# Altium project SCB.PrjPCB (part 4 of 8)

## Sheet FPGA_Configuration.SchDoc: FPGA_Configuration
size A3; Date: 18/06/2014; DrawnBy: J. Gabriel R.E.; Organization: Seven Solutions S.L.; Address1: C/Baza, Parcela 19, Nave 3; Address2: Polígono Ind. Juncaril; Address3: 18210-Peligros-Granada; Address4: Spain; Revision: 3.4; SheetNumber: 8; SheetTotal: 23; WebAddress: www.sevensols.com; Project: White Rabbit; ProjectName: Project Name
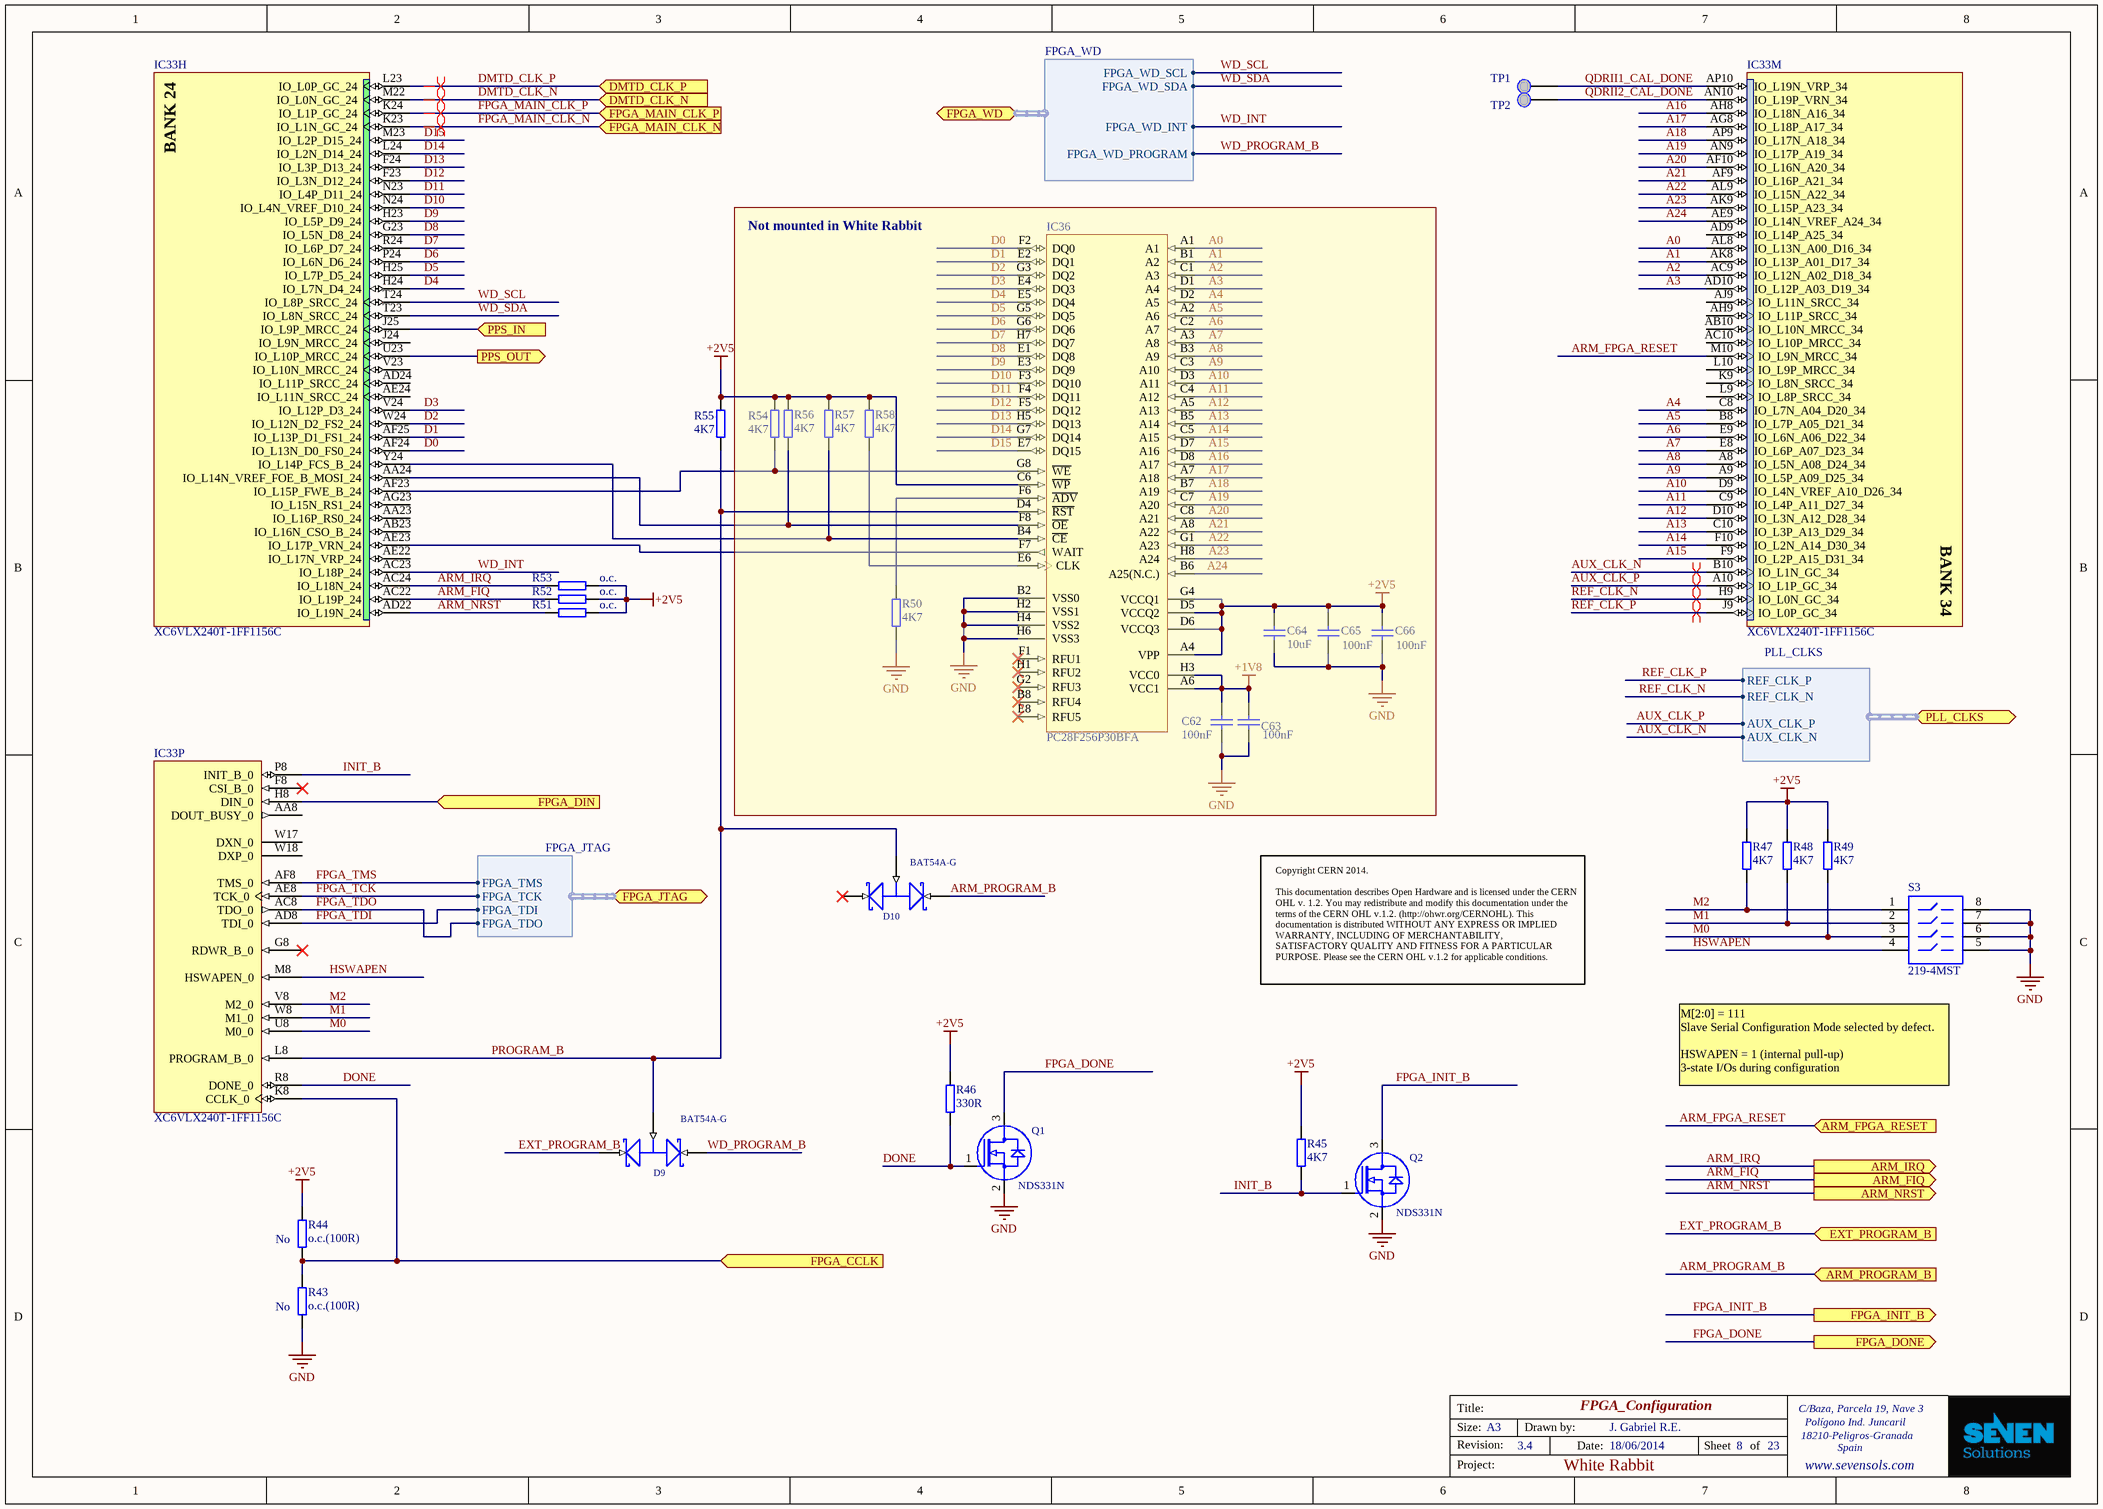
[diagram p11: FPGA_Configuration.SchDoc]

### Parts
C62  100nF  [CC1005-0402]
C63  100nF  [CC1005-0402]
C64  10uF  [CC1608-0603]
C65  100nF  [CC1005-0402]
C66  100nF  [CC1005-0402]
D9  BAT54A-G  [SOT23]
D10  BAT54A-G  [SOT23]
IC33  XC6VLX240T-1FF1156C  [FF1156]  (parts H,M,P of 20)
IC36  PC28F256P30BFA  [BGA64C100P8X8_1300X1000X120]
Q1  NDS331N  [SOT23-3]
Q2  NDS331N  [SOT23-3]
R43  value o.c.(100R)  Mounted: No  [0402]  (hidden comment: 100R(o.c.))
R44  value o.c.(100R)  Mounted: No  [0402]  (hidden comment: 100R(o.c.))
R45  4K7  [0402]
R46  330R  [0402]
R47  4K7  [0402]
R48  4K7  [0402]
R49  4K7  [0402]
R50  4K7  [0402]
R51  o.c.  [0402]
R52  o.c.  [0402]
R53  o.c.  [0402]
R54  4K7  [0402]
R55  4K7  [0402]
R56  4K7  [0402]
R57  4K7  [0402]
R58  4K7  [0402]
S3  219-4MST  [NHDS-8]
TP1  Test Point  [TEST_PAD_1mm]  (value not drawn)
TP2  Test Point  [TEST_PAD_1mm]  (value not drawn)

### Blocks framed on the sheet
Not mounted in White Rabbit: C62-C66 IC36 R50 R54 R56-R58

### Ports
ARM_FIQ (out), ARM_FPGA_RESET (in), ARM_IRQ (out), ARM_NRST (out), ARM_PROGRAM_B (in), DMTD_CLK_N (in), DMTD_CLK_P (in), EXT_PROGRAM_B (in), FPGA_CCLK (in), FPGA_DIN (in), FPGA_DONE (out), FPGA_INIT_B (out), FPGA_JTAG (harness FPGA_JTAG), FPGA_MAIN_CLK_N (in), FPGA_MAIN_CLK_P (in), FPGA_WD (harness FPGA_WD), PLL_CLKS (harness PLL_CLKS), PPS_IN (in), PPS_OUT (out)

### Harnesses
FPGA_JTAG: FPGA_TMS, FPGA_TCK, FPGA_TDI, FPGA_TDO
FPGA_WD: FPGA_WD_SCL, FPGA_WD_SDA, FPGA_WD_INT, FPGA_WD_PROGRAM
PLL_CLKS: REF_CLK_P, REF_CLK_N, AUX_CLK_P, AUX_CLK_N

### Nets
+1V8: C62.2 C63.2 IC36.A6(VCC1) IC36.H3(VCC0)
+2V5: C64.2 C65.2 C66.2 IC36.A4(VPP) IC36.C6(~{WP}) IC36.D5(VCCQ2) IC36.D6(VCCQ3) IC36.G4(VCCQ1) R44.2 R45.1 R46.2 R47.2 R48.2 R49.2 R51.1 R52.1 R53.1 R54.2 R55.2 R56.2 R57.2 R58.2
GND: C62.1 C63.1 C64.1 C65.1 C66.1 IC36.B2(VSS0) IC36.H2(VSS1) IC36.H4(VSS2) IC36.H6(VSS3) Q1.2(SOURCE) Q2.2(SOURCE) R43.1 R50.1 S3.5 S3.6 S3.7 S3.8
A0: IC33.AL8(IO_L13N_A00_D16_34) IC36.A1
A1: IC33.AK8(IO_L13P_A01_D17_34) IC36.B1(A2)
A2: IC33.AC9(IO_L12N_A02_D18_34) IC36.C1(A3)
A3: IC33.AD10(IO_L12P_A03_D19_34) IC36.D1(A4)
A4: IC33.C8(IO_L7N_A04_D20_34) IC36.D2(A5)
A5: IC33.B8(IO_L7P_A05_D21_34) IC36.A2(A6)
A6: IC33.E9(IO_L6N_A06_D22_34) IC36.C2(A7)
A7: IC33.E8(IO_L6P_A07_D23_34) IC36.A3(A8)
A8: IC33.A8(IO_L5N_A08_D24_34) IC36.B3(A9)
A9: IC33.A9(IO_L5P_A09_D25_34) IC36.C3(A10)
A10: IC33.D9(IO_L4N_VREF_A10_D26_34) IC36.D3(A11)
A11: IC33.C9(IO_L4P_A11_D27_34) IC36.C4(A12)
A12: IC33.D10(IO_L3N_A12_D28_34) IC36.A5(A13)
A13: IC33.C10(IO_L3P_A13_D29_34) IC36.B5(A14)
A14: IC33.F10(IO_L2N_A14_D30_34) IC36.C5(A15)
A15: IC33.F9(IO_L2P_A15_D31_34) IC36.D7(A16)
A16: IC33.AH8(IO_L18N_A16_34) IC36.D8(A17)
A17: IC33.AG8(IO_L18P_A17_34) IC36.A7(A18)
A18: IC33.AP9(IO_L17N_A18_34) IC36.B7(A19)
A19: IC33.AN9(IO_L17P_A19_34) IC36.C7(A20)
A20: IC33.AF10(IO_L16N_A20_34) IC36.C8(A21)
A21: IC33.AF9(IO_L16P_A21_34) IC36.A8(A22)
A22: IC33.AL9(IO_L15N_A22_34) IC36.G1(A23)
A23: IC33.AK9(IO_L15P_A23_34) IC36.H8(A24)
A24: IC33.AE9(IO_L14N_VREF_A24_34) IC36.B6(A25(N.C.))
ARM_FIQ: IC33.AC22(IO_L19P_24) R52.2 ; port ARM_FIQ
ARM_FPGA_RESET: IC33.M10(IO_L9N_MRCC_34) ; port ARM_FPGA_RESET
ARM_IRQ: IC33.AC24(IO_L18N_24) R53.2 ; port ARM_IRQ
ARM_NRST: IC33.AD22(IO_L19N_24) R51.2 ; port ARM_NRST
ARM_PROGRAM_B: D10.2(K2) ; port ARM_PROGRAM_B
AUX_CLK_N: IC33.B10(IO_L1N_GC_34) ; port PLL_CLKS.AUX_CLK_N
AUX_CLK_P: IC33.A10(IO_L1P_GC_34) ; port PLL_CLKS.AUX_CLK_P
D0: IC33.AF24(IO_L13N_D0_FS0_24) IC36.F2(DQ0)
D1: IC33.AF25(IO_L13P_D1_FS1_24) IC36.E2(DQ1)
D2: IC33.W24(IO_L12N_D2_FS2_24) IC36.G3(DQ2)
D3: IC33.V24(IO_L12P_D3_24) IC36.E4(DQ3)
D4: IC33.H24(IO_L7N_D4_24) IC36.E5(DQ4)
D5: IC33.H25(IO_L7P_D5_24) IC36.G5(DQ5)
D6: IC33.P24(IO_L6N_D6_24) IC36.G6(DQ6)
D7: IC33.R24(IO_L6P_D7_24) IC36.H7(DQ7)
D8: IC33.G23(IO_L5N_D8_24) IC36.E1(DQ8)
D9: IC33.H23(IO_L5P_D9_24) IC36.E3(DQ9)
D10: IC33.N24(IO_L4N_VREF_D10_24) IC36.F3(DQ10)
D11: IC33.N23(IO_L4P_D11_24) IC36.F4(DQ11)
D12: IC33.F23(IO_L3N_D12_24) IC36.F5(DQ12)
D13: IC33.F24(IO_L3P_D13_24) IC36.H5(DQ13)
D14: IC33.L24(IO_L2N_D14_24) IC36.G7(DQ14)
D15: IC33.M23(IO_L2P_D15_24) IC36.E7(DQ15)
DMTD_CLK_N: IC33.M22(IO_L0N_GC_24) ; port DMTD_CLK_N
DMTD_CLK_P: IC33.L23(IO_L0P_GC_24) ; port DMTD_CLK_P
DONE: IC33.R8(DONE_0) Q1.1(GATE) R46.1
EXT_PROGRAM_B: D9.1(K1) ; port EXT_PROGRAM_B
FPGA_CLK: IC33.K8(CCLK_0) R43.2 R44.1 ; port FPGA_CCLK
FPGA_DIN: IC33.H8(DIN_0) ; port FPGA_DIN
FPGA_DONE: Q1.3(DRAIN) ; port FPGA_DONE
FPGA_INIT_B: Q2.3(DRAIN) ; port FPGA_INIT_B
FPGA_MAIN_CLK_N: IC33.K23(IO_L1N_GC_24) ; port FPGA_MAIN_CLK_N  [project net FPGA_25MHZ_CLK_N]
FPGA_MAIN_CLK_P: IC33.K24(IO_L1P_GC_24) ; port FPGA_MAIN_CLK_P  [project net FPGA_25MHZ_CLK_P]
FPGA_TCK: IC33.AE8(TCK_0) ; port FPGA_JTAG.FPGA_TCK  [project net FPGA_JTAG.FPGA_TCK]
FPGA_TDI: IC33.AD8(TDI_0) ; port FPGA_JTAG.FPGA_TDI  [project net FPGA_JTAG.FPGA_TDI]
FPGA_TDO: IC33.AC8(TDO_0) ; port FPGA_JTAG.FPGA_TDO  [project net FPGA_JTAG.FPGA_TDO]
FPGA_TMS: IC33.AF8(TMS_0) ; port FPGA_JTAG.FPGA_TMS  [project net FPGA_JTAG.FPGA_TMS]
HSWAPEN: IC33.M8(HSWAPEN_0) S3.4
INIT_B: IC33.P8(INIT_B_0) Q2.1(GATE) R45.2
M0: IC33.U8(M0_0) R49.1 S3.3
M1: IC33.W8(M1_0) R48.1 S3.2
M2: IC33.V8(M2_0) R47.1 S3.1
PPS_OUT: IC33.U23(IO_L10P_MRCC_24) ; port PPS_OUT
PROGRAM_B: D9.3(A) D10.3(A) IC33.L8(PROGRAM_B_0) IC36.D4(~{RST}) R55.1
QDRII1_CAL_DONE: IC33.AP10(IO_L19N_VRP_34) TP1.1(TP)
QDRII2_CAL_DONE: IC33.AN10(IO_L19P_VRN_34) TP2.1(TP)
REF_CLK_N: IC33.H9(IO_L0N_GC_34) ; port PLL_CLKS.REF_CLK_N  [project net PLL_CLKS.REF_CLK_N]
REF_CLK_P: IC33.J9(IO_L0P_GC_34) ; port PLL_CLKS.REF_CLK_P  [project net PLL_CLKS.REF_CLK_P]
WD_INT: IC33.AC23(IO_L18P_24) ; port FPGA_WD.FPGA_WD_INT  [project net FPGA_WD.FPGA_WD_INT]
WD_PROGRAM_B: D9.2(K2) ; port FPGA_WD.FPGA_WD_PROGRAM  [project net FPGA_WD.FPGA_WD_PROGRAM]
WD_SCL: IC33.T24(IO_L8P_SRCC_24) ; port FPGA_WD.FPGA_WD_SCL  [project net FPGA_WD.FPGA_WD_SCL]
WD_SDA: IC33.T23(IO_L8N_SRCC_24) ; port FPGA_WD.FPGA_WD_SDA  [project net FPGA_WD.FPGA_WD_SDA]
NetIC33_AA24: IC33.AA24(IO_L14N_VREF_FOE_B_MOSI_24) IC36.F8(~{OE}) R56.1
NetIC33_AE23: IC33.AE23(IO_L17P_VRN_24) IC36.F7(WAIT)
NetIC33_AF23: IC33.AF23(IO_L15P_FWE_B_24) IC36.G8(~{WE}) R54.1
NetIC33_J25: IC33.J25(IO_L9P_MRCC_24) ; port PPS_IN
NetIC33_Y24: IC33.Y24(IO_L14P_FCS_B_24) IC36.B4(~{CE}) R57.1
NetIC36_E6: IC36.E6(CLK) R58.1
NetIC36_F6: IC36.F6(~{ADV}) R50.2

Not connected (* = marked no-connect by the designer): D10 1(K1)*; IC33 AA8(DOUT_BUSY_0) AA23(IO_L16P_RS0_24) AB10(IO_L10N_MRCC_34) AB23(IO_L16N_CSO_B_24) AC10(IO_L10P_MRCC_34) AD9(IO_L14P_A25_34) AD24(IO_L11P_SRCC_24) AE22(IO_L17N_VRP_24) AE24(IO_L11N_SRCC_24) AG23(IO_L15N_RS1_24) AH9(IO_L11P_SRCC_34) AJ9(IO_L11N_SRCC_34) F8(CSI_B_0)* G8(RDWR_B_0)* J24(IO_L9N_MRCC_24) K9(IO_L8N_SRCC_34) L9(IO_L8P_SRCC_34) L10(IO_L9P_MRCC_34) V23(IO_L10N_MRCC_24) W17(DXN_0) W18(DXP_0); IC36 B8(RFU4)* E8(RFU5)* F1(RFU1)* G2(RFU3)* H1(RFU2)*

### Layout directives
differential pair: AUX_CLK_N, AUX_CLK_P, DMTD_CLK_N, DMTD_CLK_P, FPGA_25MHZ_CLK_N, FPGA_25MHZ_CLK_P, PLL_CLKS.REF_CLK_N, PLL_CLKS.REF_CLK_P

### Notes on the sheet
- Copyright CERN 2014.
  This documentation describes Open Hardware and is licensed under the CERN OHL v. 1.2. You may redistribute and modify this documentation under the terms of the CERN OHL v.1.2. (http://ohwr.org/CERNOHL). This documentation is distributed WITHOUT ANY EXPRESS OR IMPLIED WARRANTY, INCLUDING OF MERCHANTABILITY, SATISFACTORY QUALITY AND FITNESS FOR A PARTICULAR PURPOSE. Please see the CERN OHL v.1.2 for applicable conditions.
- M[2:0] = 111
  Slave Serial Configuration Mode selected by defect.
  HSWAPEN = 1 (internal pull-up)
  3-state I/Os during configuration
- Title:
- Size:
- Revision:
- A3
- Drawn by:
- Date:
- Sheet
- of
- Project:
- (in symbol XC6VLX130T-1FF1156C, part H) BANK 24
- (in symbol XC6VLX130T-1FF1156C, part M) BANK 34

### Library data of the parts
C62 C63 C65 C66 = CC0402_100NF_16V_10%_X7R: Capacitor; Manufacturer1: TDK; Manufacturer1 PN: C1005X7R1C104K; TC: X7R; Tolerance: ±10%; Voltage: 16V; Mounted: No; Published: 8-Jun-2000; LatestRevisionDate: 17-Jul-2002; LatestRevisionNote: Re-released for DXP Platform.; PackageReference: RAD-0.3; Publisher: Altium Limited; Distributor1: Digikey; Distributor1 PN: 445-4952-1-ND; Case: 0402; Value: 100nF
C64 = CC0603_10UF_6.3V_20%_X5R: Capacitor; Manufacturer1: TDK; Manufacturer1 PN: C1608X5R0J106M; TC: X5R; Tolerance: ±20%; Voltage: 6.3V; Mounted: No; Published: 8-Jun-2000; LatestRevisionDate: 17-Jul-2002; LatestRevisionNote: Re-released for DXP Platform.; PackageReference: RAD-0.3; Publisher: Altium Limited; Distributor1: Digikey; Distributor1 PN: 445-4112-1-ND; Case: 0603; Value: 10uF
D9 D10 = BAT54A.1: Schottky Barrier Double Diode; PACKAGE_INFORMATION: Latest Revision: May-1999; DEVICE: BAT54A-G; PKG_TYPE: SOT23; PUBLISHED: 17-Sep-2003; DATASHEET: Latest Revision: 4-Mar-2002; PACKAGE_REFERENCE: SOT23; PUBLISHER: Altium Limited; Value: BAT54A-G; Distributor1 PN: 641-1319-1-ND; Distributor1: Digikey
IC33 = XC6VLX130T-1FF1156C: Virtex-6 LXT Platform FPGA, 600 User I/Os, 20 GTXs, 1156-Ball FFBGA, Speed Grade 1, Commercial Grade; FirstPublished: 17-Nov-2009; DatasheetVersion: v2.0, Sep-2009; PackageVersion: ver1.0, Jun-2009; PackageReference: FF1156; Publisher: Altium Limited; PackageDescription: 1156-Ball Flip-Chip Fine Pitch Ball Grid Array (FF1156); Code_JEDEC: MS-034-AAR-1; Code_IPC: BGA100P34X34-1156; ComponentLink1Description: Virtex-6 Datasheet; ComponentLink1URL: http://www.xilinx.com/support/documentation/data_sheets/ds150.pdf; ComponentLink2Description: Pinout Specification; ComponentLink2URL: http://www.xilinx.com/support/packagefiles/virtex-6-pkgs.htm; ComponentLink3Description: FF1156 Package Drawing; ComponentLink3URL: http://www.xilinx.com/support/documentation/package_specs/ff1156.pdf; ComponentLink4Description: Virtex-6 Documents; ComponentLink4URL: http://www.xilinx.com/support/documentation/virtex-6.htm; ComponentLink5Description: Xilinx.com Home; ComponentLink5URL: http://www.xilinx.com
IC36 = PC28F256P30BFA: NOR Flash Memory, 256Mbit; Mounted: No; Value: PC28F256P30BFA; Distributor1 PN: PC28F256P30BFA-ND; Distributor1: Digikey; Case: TBGA-64
Q1 Q2 = NDS331N: N-Channel Logic Level Enhancement Mode Field Effect Transistor; DEVICE: NDS331N; VALUE: NDS331N; Distributor1 PN: NDS331NCT-ND; Distributor1: Digikey
R43 R44 = R0402_100R_±1%_0.1W_100PPM: SMD Resistor; Manufacturer1: Panasonic; Manufacturer1 PN: ERJ-2RKF1000X; TCR: 100ppm; Power Rating: 0.1W; Tolerance: ±1%; Case: 0402; Distributor1: DigiKey; Distributor1 PN: P100LCT-ND
R45 R47-R49 R55 = R0402_4.7K_±1%_0.1W_100PPM: SMD Resistor; Manufacturer1: Panasonic; Manufacturer1 PN: ERJ-2RKF4701X; TCR: 100ppm; Power Rating: 0.1W; Tolerance: ±1%; Case: 0402; Distributor1: DigiKey; Distributor1 PN: ERJ-2RKF4701X; Value: 4K7
R46 = R0402_330R_±1%_0.1W_100PPM: SMD Resistor; Manufacturer1: Panasonic; Manufacturer1 PN: ERJ-2RKF3300X; TCR: 100ppm; Power Rating: 0.1W; Tolerance: ±1%; Case: 0402; Distributor1: DigiKey; Distributor1 PN: P330LCT-ND; Value: 330R
R50 R54 R56-R58 = R0402_4.7K_±1%_0.1W_100PPM: SMD Resistor; Manufacturer1: Panasonic; Manufacturer1 PN: ERJ-2RKF4701X; TCR: 100ppm; Power Rating: 0.1W; Tolerance: ±1%; Mounted: No; Case: 0402; Distributor1: DigiKey; Distributor1 PN: ERJ-2RKF4701X; Value: 4K7
R51-R53 = R0402_O.C.: SMD Resistor; Mounted: No; Case: 0402; Manufacturer1: N/A; Manufacturer1 PN: N/A; Distributor1: N/A; Distributor1 PN: N/A; TCR: N/A; Power Rating: N/A; Tolerance: N/A; Value: o.c.
S3 = SW-DIP4: 4 Positions DIP SWITCH; Manufacturer: CTS Electrocomponents; Mounted: No; Value: 219-4MST; Distributor1 PN: CT2194MST-ND; Distributor1: Digikey
TP1 TP2 = TEST_POINT: SMD 1mm Test Point

## Sheet CPU_IO_Ports.SchDoc: CPU_IO_Ports
size A4; Date: 18/06/2014; DrawnBy: J. Gabriel R.E.; Organization: Seven Solutions S.L.; Address1: C/Baza, Parcela 19, Nave 3; Address2: Polígono Ind. Juncaril; Address3: 18210-Peligros-Granada; Address4: Spain; Revision: 3.4; SheetNumber: 9; SheetTotal: 23; WebAddress: www.sevensols.com; Project: White Rabbit; ProjectName: White Rabbit
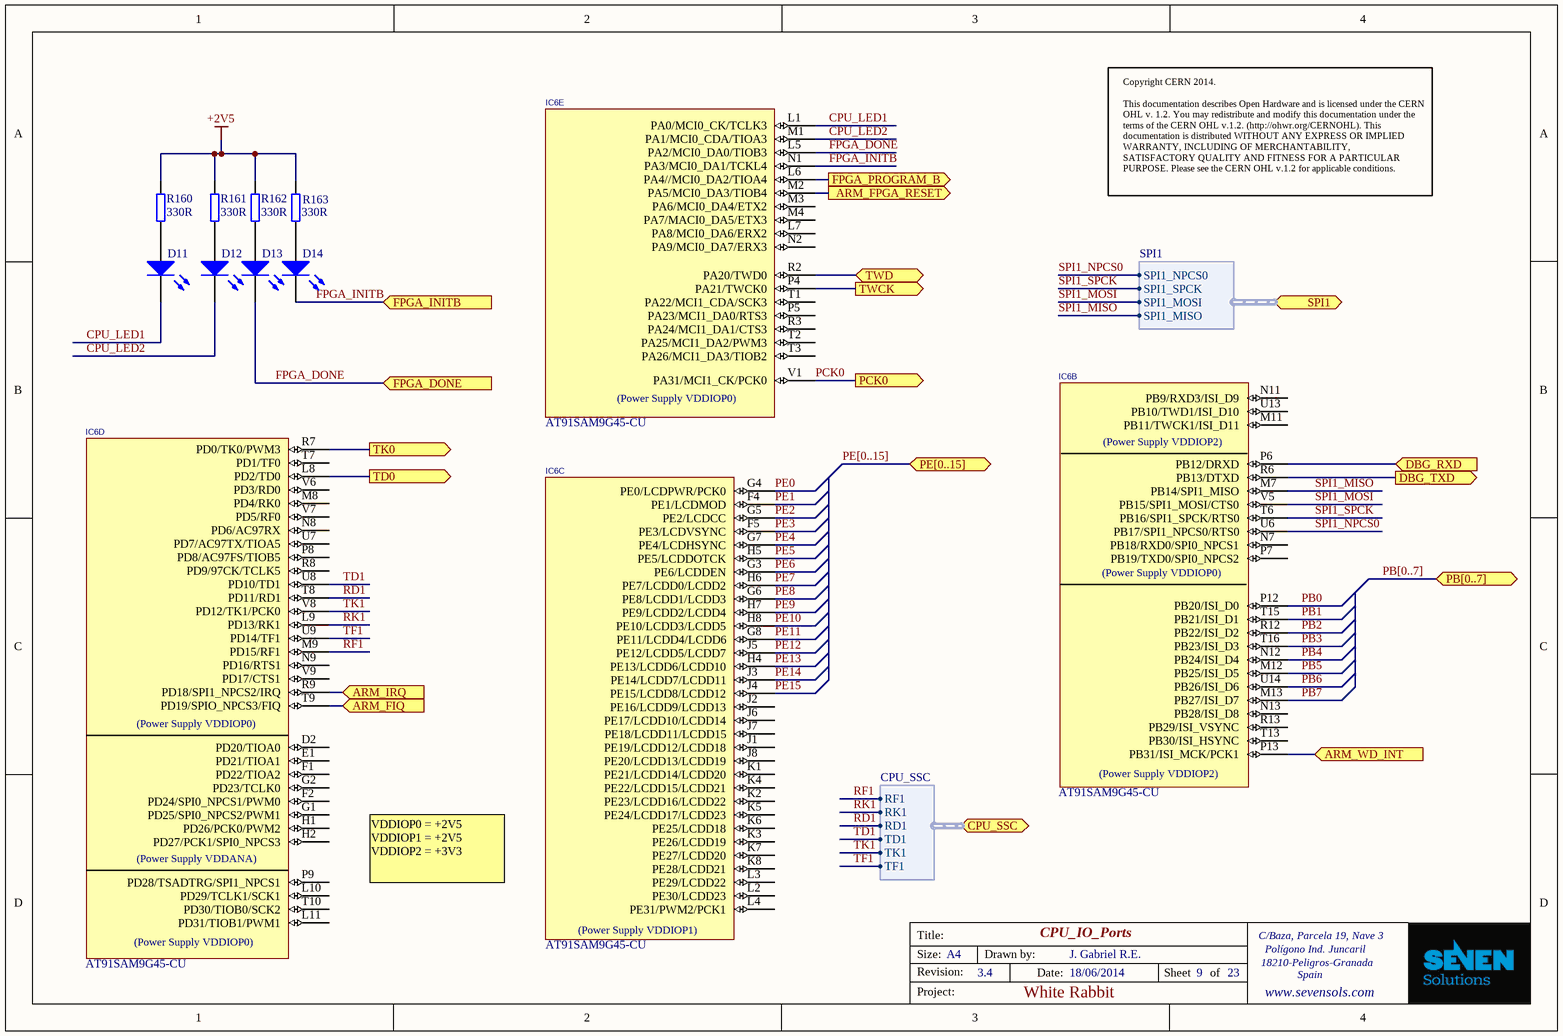
[diagram p12: CPU_IO_Ports.SchDoc]

### Parts
D11  LED  [CD1608-0603]  (value not drawn)
D12  LED  [CD1608-0603]  (value not drawn)
D13  LED  [CD1608-0603]  (value not drawn)
D14  LED  [CD1608-0603]  (value not drawn)
IC6  AT91SAM9G45-CU  [TFBGA324]  (parts B,C,D,E of 12)
R160  330R  [0402]
R161  330R  [0402]
R162  330R  [0402]
R163  330R  [0402]

### Ports
ARM_FIQ (in), ARM_FPGA_RESET (out), ARM_IRQ (in), ARM_WD_INT (in), CPU_SSC (harness CPU_SSC), DBG_RXD (in), DBG_TXD (out), FPGA_DONE (in), FPGA_INITB (in), FPGA_PROGRAM_B (out), PB[0..7] (bidir), PCK0 (out), PE[0..15] (bidir), SPI1 (harness SPI1), TD0 (out), TK0 (out), TWCK (out), TWD (bidir)

### Harnesses
CPU_SSC: TF1, TK1, TD1, RD1, RK1, RF1
SPI1: SPI1_MISO, SPI1_MOSI, SPI1_SPCK, SPI1_NPCS0

### Nets
+2V5: R160.2 R161.2 R162.2 R163.2
ARM_DEBUG_RXD: IC6.P6(PB12/DRXD) ; port DBG_RXD
ARM_DEBUG_TXD: IC6.R6(PB13/DTXD) ; port DBG_TXD
ARM_FIQ: IC6.T9(PD19/SPIO_NPCS3/FIQ) ; port ARM_FIQ
ARM_FPGA_RESET: IC6.M2(PA5/MCI0_DA3/TIOB4) ; port ARM_FPGA_RESET
ARM_IRQ: IC6.R9(PD18/SPI1_NPCS2/IRQ) ; port ARM_IRQ
ARM_PROGRAM_B: IC6.L6(PA4//MCI0_DA2/TIOA4) ; port FPGA_PROGRAM_B
CPU_LED1: D11.2(K) IC6.L1(PA0/MCI0_CK/TCLK3)
CPU_LED2: D12.2(K) IC6.M1(PA1/MCI0_CDA/TIOA3)
FPGA_CLK: IC6.R7(PD0/TK0/PWM3) ; port TK0
FPGA_DIN: IC6.L8(PD2/TD0) ; port TD0
FPGA_DONE: D13.2(K) IC6.L5(PA2/MCI0_DA0/TIOB3) ; port FPGA_DONE
FPGA_INITB: D14.2(K) IC6.N1(PA3/MCI0_DA1/TCKL4) ; port FPGA_INITB  [project net FPGA_INIT_B]
PB0: IC6.P12(PB20/ISI_D0)
PB1: IC6.T15(PB21/ISI_D1)
PB2: IC6.R12(PB22/ISI_D2)
PB3: IC6.T16(PB23/ISI_D3)
PB4: IC6.N12(PB24/ISI_D4)
PB5: IC6.M12(PB25/ISI_D5)
PB6: IC6.U14(PB26/ISI_D6)
PB7: IC6.M13(PB27/ISI_D7)
PCK0: IC6.V1(PA31/MCI1_CK/PCK0) ; port PCK0  [project net ARM_PCK0]
PE0: IC6.G4(PE0/LCDPWR/PCK0)
PE1: IC6.F4(PE1/LCDMOD)
PE2: IC6.G5(PE2/LCDCC)
PE3: IC6.F5(PE3/LCDVSYNC)
PE4: IC6.G7(PE4/LCDHSYNC)
PE5: IC6.H5(PE5/LCDDOTCK)
PE6: IC6.G3(PE6/LCDDEN)
PE7: IC6.H6(PE7/LCDD0/LCDD2)
PE8: IC6.G6(PE8/LCDD1/LCDD3)
PE9: IC6.H7(PE9/LCDD2/LCDD4)
PE10: IC6.H8(PE10/LCDD3/LCDD5)
PE11: IC6.G8(PE11/LCDD4/LCDD6)
PE12: IC6.J5(PE12/LCDD5/LCDD7)
PE13: IC6.H4(PE13/LCDD6/LCDD10)
PE14: IC6.J3(PE14/LCDD7/LCDD11)
PE15: IC6.J4(PE15/LCDD8/LCDD12)
RD1: IC6.T8(PD11/RD1) ; port CPU_SSC.RD1  [project net CPU_SSC.RD1]
RF1: IC6.M9(PD15/RF1) ; port CPU_SSC.RF1  [project net CPU_SSC.RF1]
RK1: IC6.L9(PD13/RK1) ; port CPU_SSC.RK1  [project net CPU_SSC.RK1]
SPI1_MISO: IC6.M7(PB14/SPI1_MISO) ; port SPI1.SPI1_MISO  [project net SPI1.SPI1_MISO]
SPI1_MOSI: IC6.V5(PB15/SPI1_MOSI/CTS0) ; port SPI1.SPI1_MOSI  [project net SPI1.SPI1_MOSI]
SPI1_NPCS0: IC6.U6(PB17/SPI1_NPCS0/RTS0) ; port SPI1.SPI1_NPCS0  [project net SPI1.SPI1_NPCS0]
SPI1_SPCK: IC6.T6(PB16/SPI1_SPCK/RTS0) ; port SPI1.SPI1_SPCK  [project net SPI1.SPI1_SPCK]
TD1: IC6.U8(PD10/TD1) ; port CPU_SSC.TD1  [project net CPU_SSC.TD1]
TF1: IC6.U9(PD14/TF1) ; port CPU_SSC.TF1  [project net CPU_SSC.TF1]
TK1: IC6.V8(PD12/TK1/PCK0) ; port CPU_SSC.TK1  [project net CPU_SSC.TK1]
NetD11_1: D11.1(A) R160.1
NetD12_1: D12.1(A) R161.1
NetD13_1: D13.1(A) R162.1
NetD14_1: D14.1(A) R163.1
NetIC2_6: IC6.R2(PA20/TWD0) ; port TWD
NetIC2_7: IC6.P4(PA21/TWCK0) ; port TWCK
NetIC2_8: IC6.P13(PB31/ISI_MCK/PCK1) ; port ARM_WD_INT

Not connected (* = marked no-connect by the designer): IC6 D2(PD20/TIOA0) E1(PD21/TIOA1) F1(PD22/TIOA2) F2(PD24/SPI0_NPCS1/PWM0) G1(PD25/SPI0_NPCS2/PWM1) G2(PD23/TCLK0) H1(PD26/PCK0/PWM2) H2(PD27/PCK1/SPI0_NPCS3) J1(PE19/LCDD12/LCDD18) J2(PE16/LCDD9/LCDD13) J6(PE17/LCDD10/LCDD14) J7(PE18/LCDD11/LCDD15) J8(PE20/LCDD13/LCDD19) K1(PE21/LCDD14/LCDD20) K2(PE23/LCDD16/LCDD22) K3(PE26/LCDD19) K4(PE22/LCDD15/LCDD21) K5(PE24/LCDD17/LCDD23) K6(PE25/LCDD18) K7(PE27/LCDD20) K8(PE28/LCDD21) L2(PE30/LCDD23) L3(PE29/LCDD22) L4(PE31/PWM2/PCK1) L7(PA8/MCI0_DA6/ERX2) L10(PD29/TCLK1/SCK1) L11(PD31/TIOB1/PWM1) M3(PA6/MCI0_DA4/ETX2) M4(PA7/MACI0_DA5/ETX3) M8(PD4/RK0) M11(PB11/TWCK1/ISI_D11) N2(PA9/MCI0_DA7/ERX3) N7(PB18/RXD0/SPI0_NPCS1) N8(PD6/AC97RX) N9(PD16/RTS1) N11(PB9/RXD3/ISI_D9) N13(PB28/ISI_D8) P5(PA23/MCI1_DA0/RTS3) P7(PB19/TXD0/SPI0_NPCS2) P8(PD8/AC97FS/TIOB5) P9(PD28/TSADTRG/SPI1_NPCS1) R3(PA24/MCI1_DA1/CTS3) R8(PD9/97CK/TCLK5) R13(PB29/ISI_VSYNC) T1(PA22/MCI1_CDA/SCK3) T2(PA25/MCI1_DA2/PWM3) T3(PA26/MCI1_DA3/TIOB2) T7(PD1/TF0) T10(PD30/TIOB0/SCK2) T13(PB30/ISI_HSYNC) U7(PD7/AC97TX/TIOA5) U13(PB10/TWD1/ISI_D10) V6(PD3/RD0) V7(PD5/RF0) V9(PD17/CTS1)

### Buses and harness runs
bus PB[0..7] = port PB[0..7]
bus PE[0..15] = port PE[0..15]

### Notes on the sheet
- Copyright CERN 2014.
  This documentation describes Open Hardware and is licensed under the CERN OHL v. 1.2. You may redistribute and modify this documentation under the terms of the CERN OHL v.1.2. (http://ohwr.org/CERNOHL). This documentation is distributed WITHOUT ANY EXPRESS OR IMPLIED WARRANTY, INCLUDING OF MERCHANTABILITY, SATISFACTORY QUALITY AND FITNESS FOR A PARTICULAR PURPOSE. Please see the CERN OHL v.1.2 for applicable conditions.
- VDDIOP0 = +2V5
  VDDIOP1 = +2V5
  VDDIOP2 = +3V3
- Title:
- Size:
- Revision:
- A4
- Drawn by:
- Date:
- Sheet
- of
- Project:
- (in symbol AT91SAM9G45-CU, part B) (Power Supply VDDIOP2); (Power Supply VDDIOP0)
- (in symbol AT91SAM9G45-CU, part C) (Power Supply VDDIOP1)
- (in symbol AT91SAM9G45-CU, part D) (Power Supply VDDIOP0); (Power Supply VDDANA)
- (in symbol AT91SAM9G45-CU, part E) (Power Supply VDDIOP0)

### Library data of the parts
D11-D14 = LED0: Typical INFRARED GaAs LED; Value: LG L29K-G2J1-24-Z; Published: 8-Jun-2000; LatestRevisionDate: 08-Jul-2005; LatestRevisionNote: Mech Layer 1 removed.; PackageReference: LED-0; Publisher: Altium Limited; Distributor1: Digikey; Distributor1 PN: 475-2709-1-ND
IC6 = AT91SAM9G45-CU: Atmel 400MHz ARM926 MCU; Value: AT91SAM9G45-CU; Distributor1 PN: AT91SAM9G45-CU-ND; Distributor1: Digikey
R160-R163 = R0402_330R_±1%_0.1W_100PPM: as R46 on sheet FPGA_Configuration; Case: 0402; Distributor1: DigiKey; Distributor1 PN: P330LCT-ND; Value: 330R

## Sheet SCB_PLLs.SchDoc: SCB_PLLs
size A3; Date: 18/06/2014; DrawnBy: J. Gabriel R.E.; Organization: Seven Solutions S.L.; Address1: C/Baza, Parcela 19, Nave 3; Address2: Polígono Ind. Juncaril; Address3: 18210-Peligros-Granada; Address4: Spain; Revision: 3.4; SheetNumber: 17; SheetTotal: 23; WebAddress: www.sevensols.com; Project: White Rabbit; ProjectName: Project Name
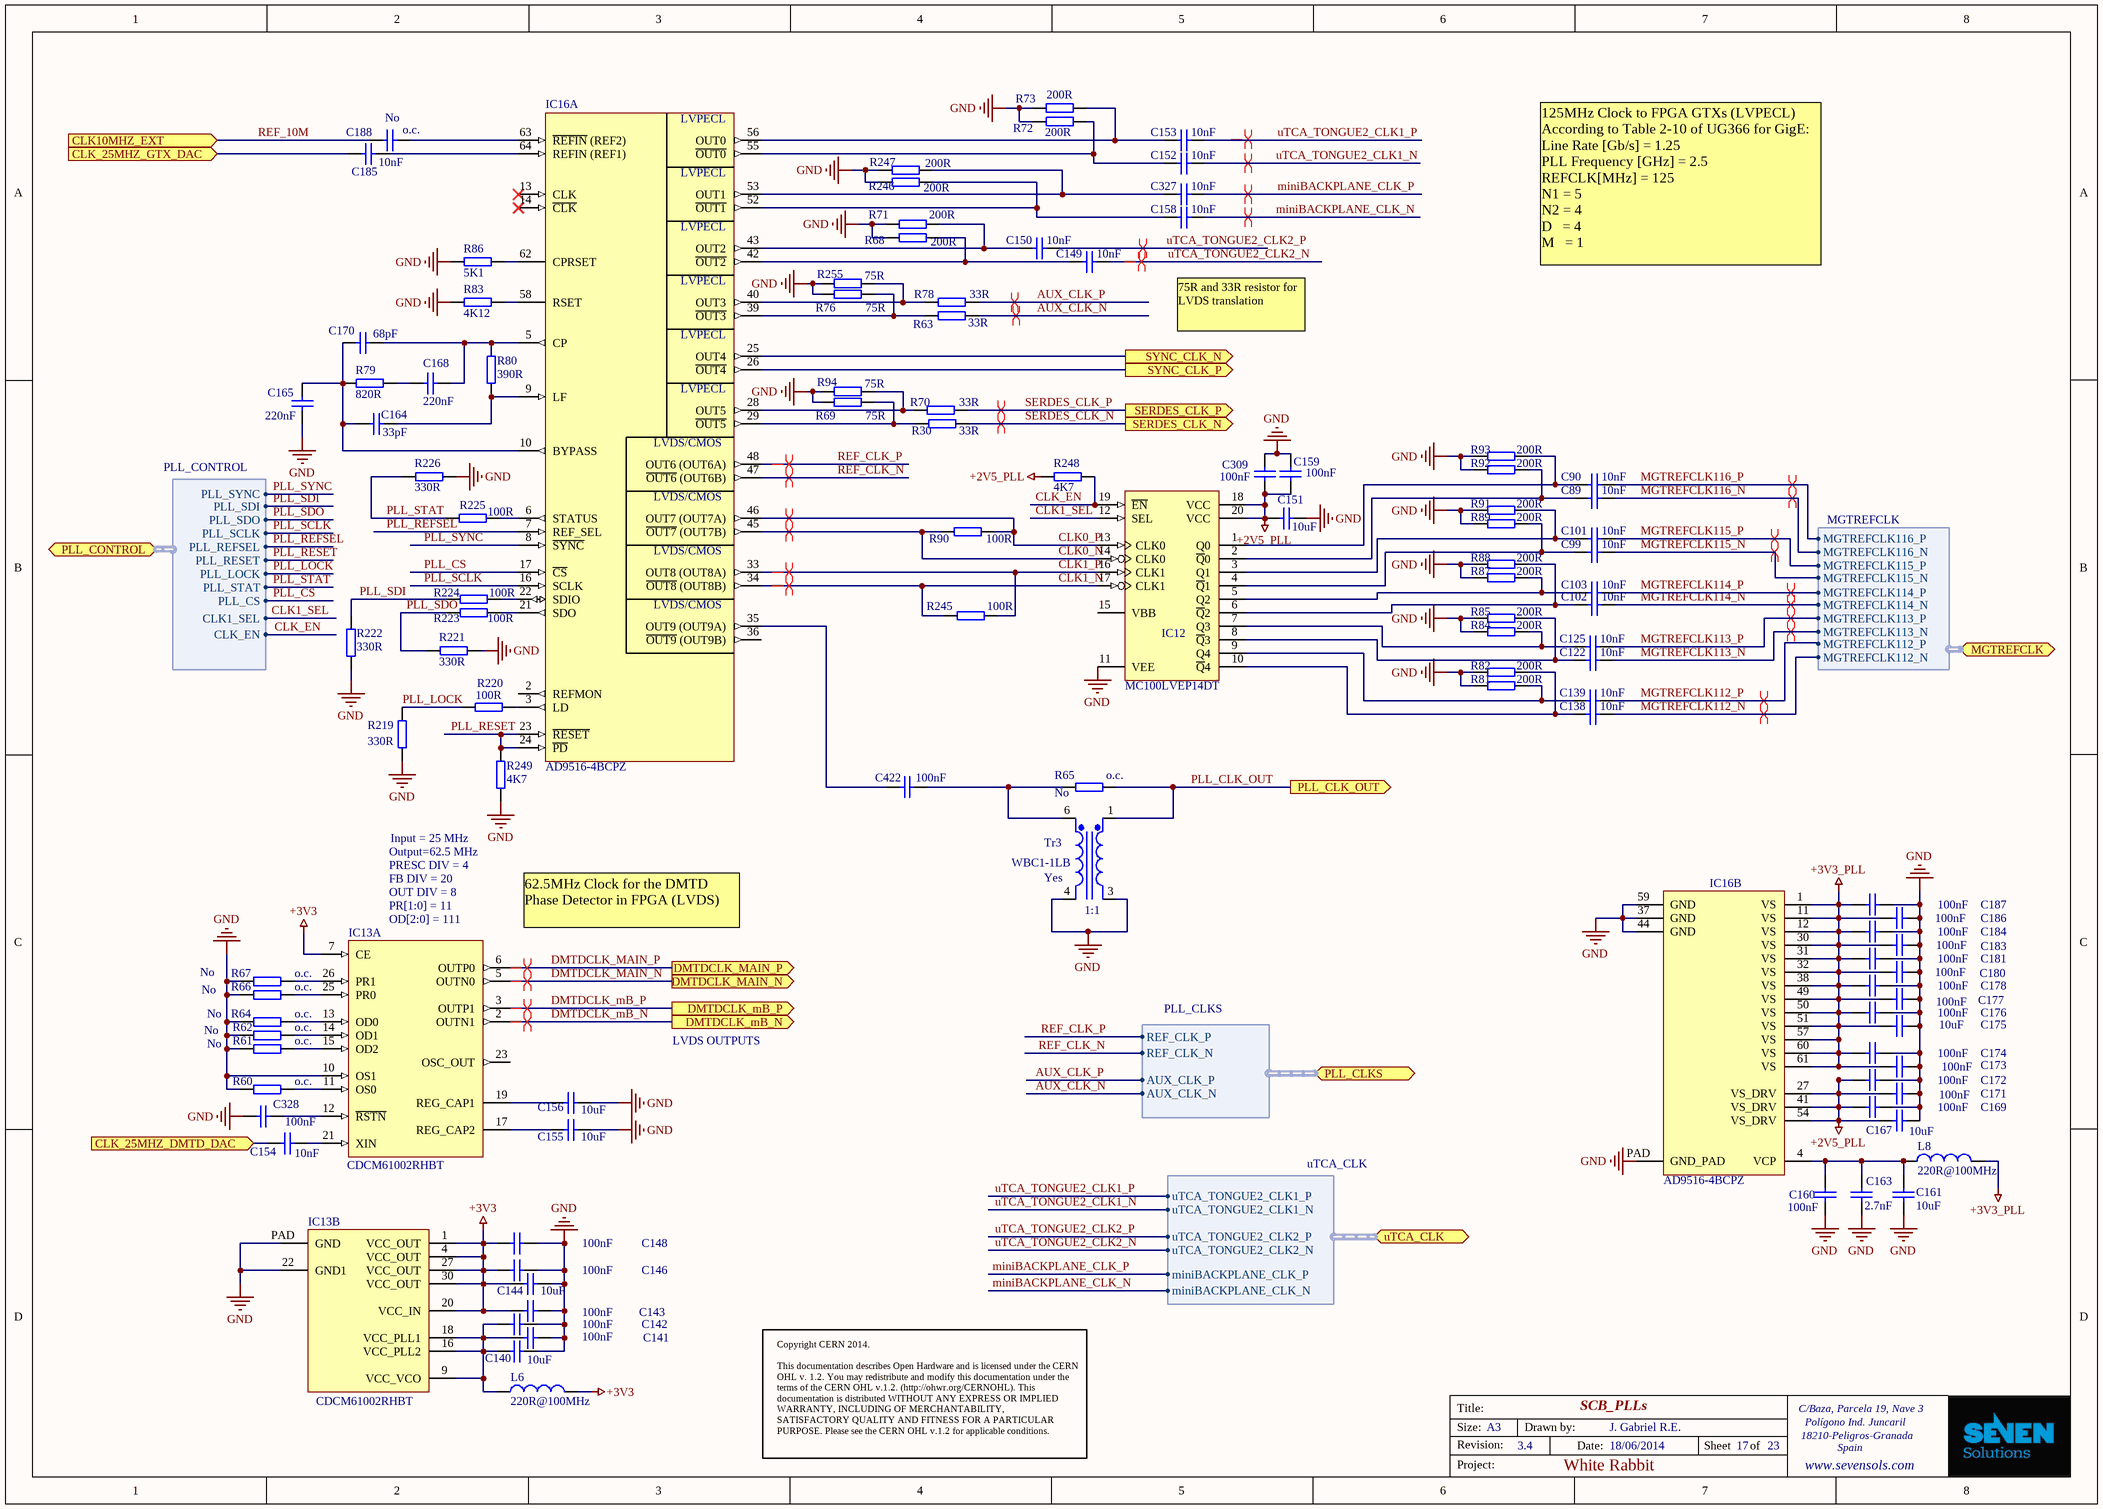
[diagram p13: SCB_PLLs.SchDoc]

### Parts
C89  10nF  [CC1005-0402]
C90  10nF  [CC1005-0402]
C99  10nF  [CC1005-0402]
C101  10nF  [CC1005-0402]
C102  10nF  [CC1005-0402]
C103  10nF  [CC1005-0402]
C122  10nF  [CC1005-0402]
C125  10nF  [CC1005-0402]
C138  10nF  [CC1005-0402]
C139  10nF  [CC1005-0402]
C140  10uF  [CC1608-0603]
C141  100nF  [CC1005-0402]
C142  100nF  [CC1005-0402]
C143  100nF  [CC1005-0402]
C144  10uF  [CC1608-0603]
C146  100nF  [CC1005-0402]
C148  100nF  [CC1005-0402]
C149  10nF  [CC1005-0402]
C150  10nF  [CC1005-0402]
C151  10uF  [CC1608-0603]
C152  10nF  [CC1005-0402]
C153  10nF  [CC1005-0402]
C154  10nF  [CC1005-0402]
C155  10uF  [CC1608-0603]
C156  10uF  [CC1608-0603]
C158  10nF  [CC1005-0402]
C159  100nF  [CC1005-0402]
C160  100nF  [CC1005-0402]
C161  10uF  [CC1608-0603]
C163  2.7nF  [CC1005-0402]
C164  33pF  [CC1608-0603]
C165  220nF  [CC1608-0603]
C167  10uF  [CC1608-0603]
C168  220nF  [CC1608-0603]
C169  100nF  [CC1005-0402]
C170  68pF  [CC1608-0603]
C171  100nF  [CC1005-0402]
C172  100nF  [CC1005-0402]
C173  100nF  [CC1005-0402]
C174  100nF  [CC1005-0402]
C175  10uF  [CC1608-0603]
C176  100nF  [CC1005-0402]
C177  100nF  [CC1005-0402]
C178  100nF  [CC1005-0402]
C180  100nF  [CC1005-0402]
C181  100nF  [CC1005-0402]
C183  100nF  [CC1005-0402]
C184  100nF  [CC1005-0402]
C185  10nF  [CC1005-0402]
C186  100nF  [CC1005-0402]
C187  100nF  [CC1005-0402]
C188  o.c.  Mounted: No  [CC1005-0402]
C309  100nF  [CC1005-0402]
C327  10nF  [CC1005-0402]
C328  100nF  [CC1005-0402]
C422  100nF  [CC1005-0402]
IC12  MC100LVEP14DT  [948E-02_N]
IC13  CDCM61002RHBT  [QFN32_POWERPAD]  (parts A,B of 2)
IC16  AD9516-4BCPZ  [QFN50P900X900X100-64M]  (parts A,B of 2)
L6  Impedance: 220R@100MHz  [0603]  (hidden comment: 220R@100MHz Ferrite Bead)
L8  Impedance: 220R@100MHz  [0603]  (hidden comment: 220R@100MHz Ferrite Bead)
R30  33R  [0402]
R60  o.c.  [0402]
R61  Mounted: No  [0402]  (hidden comment: o.c.)
R62  Mounted: No  [0402]  (hidden comment: o.c.)
R63  33R  [0402]
R64  Mounted: No  [0402]  (hidden comment: o.c.)
R65  Mounted: No  [0402]  (hidden comment: o.c.)
R66  Mounted: No  [0402]  (hidden comment: o.c.)
R67  Mounted: No  [0402]  (hidden comment: o.c.)
R68  200R  [0402]
R69  75R  [0402]
R70  33R  [0402]
R71  200R  [0402]
R72  200R  [0402]
R73  200R  [0402]
R76  75R  [0402]
R78  33R  [0402]
R79  820R  [0603]
R80  390R  [0603]
R81  200R  [0402]
R82  200R  [0402]
R83  4K12  [0402]
R84  200R  [0402]
R85  200R  [0402]
R86  5K1  [0402]
R87  200R  [0402]
R88  200R  [0402]
R89  200R  [0402]
R90  100R  [0402]
R91  200R  [0402]
R92  200R  [0402]
R93  200R  [0402]
R94  75R  [0402]
R219  330R  [0402]
R220  100R  [0402]
R221  330R  [0402]
R222  330R  [0402]
R223  100R  [0402]
R224  100R  [0402]
R225  100R  [0402]
R226  330R  [0402]
R245  100R  [0402]
R246  200R  [0402]
R247  200R  [0402]
R248  4K7  [0402]
R249  4K7  [0402]
R255  75R  [0402]
Tr3  WBC1-1LB  value 1:1  Mounted: Yes  [SMT6P150P]

### Ports
CLK10MHZ_EXT (in), CLK_25MHZ_DMTD_DAC (in), CLK_25MHZ_GTX_DAC (in), DMTDCLK_MAIN_N (out), DMTDCLK_MAIN_P (out), DMTDCLK_mB_N (out), DMTDCLK_mB_P (out), MGTREFCLK (harness MGTREFCLK), PLL_CLK_OUT (out), PLL_CLKS (harness PLL_CLKS), PLL_CONTROL (harness PLL_CONTROL), SERDES_CLK_N (out), SERDES_CLK_P (out), SYNC_CLK_N (out), SYNC_CLK_P (out), uTCA_CLK (harness uTCA_CLK)

### Harnesses
PLL_CONTROL: PLL_CS, PLL_STAT, PLL_LOCK, PLL_RESET, PLL_REFSEL, PLL_SCLK, PLL_SDO, PLL_SDI, PLL_SYNC, CLK1_SEL, CLK_EN
PLL_CLKS: REF_CLK_P, REF_CLK_N, AUX_CLK_P, AUX_CLK_N
MGTREFCLK: MGTREFCLK112_P, MGTREFCLK112_N, MGTREFCLK113_P, MGTREFCLK113_N, MGTREFCLK114_P, MGTREFCLK114_N, MGTREFCLK115_P, MGTREFCLK115_N, MGTREFCLK116_P, MGTREFCLK116_N
uTCA_CLK: uTCA_TONGUE2_CLK1_P, uTCA_TONGUE2_CLK1_N, uTCA_TONGUE2_CLK2_P, uTCA_TONGUE2_CLK2_N, miniBACKPLANE_CLK_P, miniBACKPLANE_CLK_N

### Nets
+2V5_PLL: C151.2 C159.2 C167.1 C169.2 C171.2 C172.2 C309.2 IC12.18(VCC) IC12.20(VCC) IC16.27(VS_DRV) IC16.41(VS_DRV) IC16.54(VS_DRV) R248.2
+3V3: C143.2 C144.1 C146.2 C148.2 IC13.1(VCC_OUT) IC13.4(VCC_OUT) IC13.7(CE) IC13.20(VCC_IN) IC13.27(VCC_OUT) IC13.30(VCC_OUT) L6.2
+3V3_PLL: C173.2 C174.2 C175.1 C176.2 C177.2 C178.2 C180.2 C181.2 C183.2 C184.2 C186.2 C187.2 IC16.1(VS) IC16.11(VS) IC16.12(VS) IC16.30(VS) IC16.31(VS) IC16.32(VS) IC16.38(VS) IC16.49(VS) IC16.50(VS) IC16.51(VS) IC16.57(VS) IC16.60(VS) IC16.61(VS) L8.2
GND: C140.2 C141.1 C142.1 C143.1 C144.2 C146.1 C148.1 C151.1 C155.2 C156.2 C159.1 C160.2 C161.1 C163.1 C165.1 C167.2 C169.1 C171.1 C172.1 C173.1 C174.1 C175.2 C176.1 C177.1 C178.1 C180.1 C181.1 C183.1 C184.1 C186.1 C187.1 C309.1 C328.2 IC12.11(VEE) IC13.10(OS1) IC13.22(GND1) IC13.PAD(GND) IC16.37(GND) IC16.44(GND) IC16.59(GND) IC16.PAD(GND_PAD) R60.2 R61.2 R62.2 R64.2 R66.2 R67.2 R68.2 R69.1 R71.2 R72.2 R73.2 R76.1 R81.2 R82.2 R83.1 R84.2 R85.2 R86.1 R87.2 R88.2 R89.2 R91.2 R92.2 R93.2 R94.1 R219.1 R221.1 R222.1 R226.1 R246.2 R247.2 R249.1 R255.1 Tr3.3(Sec-) Tr3.4(Pri-)
AUX_CLK_N: R63.2 ; port PLL_CLKS.AUX_CLK_N
AUX_CLK_P: R78.2 ; port PLL_CLKS.AUX_CLK_P
CLK0_N: IC12.14(CLK0) IC16.45(~{OUT7}_(OUT7B)) R90.1
CLK0_P: IC12.13(CLK0) IC16.46(OUT7_(OUT7A)) R90.2
CLK1_N: IC12.17(CLK1) IC16.34(~{OUT8}_(OUT8B)) R245.1
CLK1_P: IC12.16(CLK1) IC16.33(OUT8_(OUT8A)) R245.2
CLK1_SEL: IC12.12(SEL) ; port PLL_CONTROL.CLK1_SEL
CLK_EN: IC12.19(~{EN}) R248.1 ; port PLL_CONTROL.CLK_EN
DMTDCLK_MAIN_N: IC13.5(OUTN0) ; port DMTDCLK_MAIN_N  [project net DMTD_CLK_N]
DMTDCLK_MAIN_P: IC13.6(OUTP0) ; port DMTDCLK_MAIN_P  [project net DMTD_CLK_P]
DMTDCLK_mB_N: IC13.2(OUTN1) ; port DMTDCLK_mB_N
DMTDCLK_mB_P: IC13.3(OUTP1) ; port DMTDCLK_mB_P
MGTREFCLK112_N: C138.1 ; port MGTREFCLK.MGTREFCLK112_N  [project net MGTREFCLK.MGTREFCLK112_N]
MGTREFCLK112_P: C139.1 ; port MGTREFCLK.MGTREFCLK112_P  [project net MGTREFCLK.MGTREFCLK112_P]
MGTREFCLK113_N: C122.1 ; port MGTREFCLK.MGTREFCLK113_N  [project net MGTREFCLK.MGTREFCLK113_N]
MGTREFCLK113_P: C125.1 ; port MGTREFCLK.MGTREFCLK113_P  [project net MGTREFCLK.MGTREFCLK113_P]
MGTREFCLK114_N: C102.1 ; port MGTREFCLK.MGTREFCLK114_N  [project net MGTREFCLK.MGTREFCLK114_N]
MGTREFCLK114_P: C103.1 ; port MGTREFCLK.MGTREFCLK114_P  [project net MGTREFCLK.MGTREFCLK114_P]
MGTREFCLK115_N: C99.1 ; port MGTREFCLK.MGTREFCLK115_N  [project net MGTREFCLK.MGTREFCLK115_N]
MGTREFCLK115_P: C101.1 ; port MGTREFCLK.MGTREFCLK115_P  [project net MGTREFCLK.MGTREFCLK115_P]
MGTREFCLK116_N: C89.1 ; port MGTREFCLK.MGTREFCLK116_N  [project net MGTREFCLK.MGTREFCLK116_N]
MGTREFCLK116_P: C90.1 ; port MGTREFCLK.MGTREFCLK116_P  [project net MGTREFCLK.MGTREFCLK116_P]
miniBACKPLANE_CLK_N: C158.1 ; port uTCA_CLK.miniBACKPLANE_CLK_N
miniBACKPLANE_CLK_P: C327.1 ; port uTCA_CLK.miniBACKPLANE_CLK_P
PLL_CLK_OUT: R65.1 Tr3.1(Sec+) ; port PLL_CLK_OUT
PLL_CS: IC16.17(~{CS}) ; port PLL_CONTROL.PLL_CS  [project net PLL_CONTROL.PLL_CS]
PLL_LOCK: R219.2 R220.2 ; port PLL_CONTROL.PLL_LOCK  [project net PLL_CONTROL.PLL_LOCK]
PLL_REFSEL: IC16.7(REF_SEL) ; port PLL_CONTROL.PLL_REFSEL  [project net PLL_CONTROL.PLL_REFSEL]
PLL_RESET: IC16.23(~{RESET}) IC16.24(~{PD}) R249.2 ; port PLL_CONTROL.PLL_RESET  [project net PLL_CONTROL.PLL_RESET]
PLL_SCLK: IC16.16(SCLK) ; port PLL_CONTROL.PLL_SCLK  [project net PLL_CONTROL.PLL_SCLK]
PLL_SDI: R222.2 R224.2 ; port PLL_CONTROL.PLL_SDI  [project net PLL_CONTROL.PLL_SDI]
PLL_SDO: R221.2 R223.2 ; port PLL_CONTROL.PLL_SDO  [project net PLL_CONTROL.PLL_SDO]
PLL_STAT: R225.2 R226.2 ; port PLL_CONTROL.PLL_STAT  [project net PLL_CONTROL.PLL_STAT]
PLL_SYNC: IC16.8(~{SYNC}) ; port PLL_CONTROL.PLL_SYNC  [project net PLL_CONTROL.PLL_SYNC]
REF_10M: C188.1 ; port CLK10MHZ_EXT  [project net CLK10MHZ_EXT]
REF_CLK_N: IC16.47(~{OUT6}_(OUT6B)) ; port PLL_CLKS.REF_CLK_N  [project net PLL_CLKS.REF_CLK_N]
REF_CLK_P: IC16.48(OUT6_(OUT6A)) ; port PLL_CLKS.REF_CLK_P  [project net PLL_CLKS.REF_CLK_P]
SERDES_CLK_N: R30.2 ; port SERDES_CLK_N
SERDES_CLK_P: R70.2 ; port SERDES_CLK_P
SYNC_CLK_N: IC16.25(OUT4) ; port SYNC_CLK_N
SYNC_CLK_P: IC16.26(~{OUT4}) ; port SYNC_CLK_P
uTCA_TONGUE2_CLK1_N: C152.1 ; port uTCA_CLK.uTCA_TONGUE2_CLK1_N  [project net uTCA_CLK.uTCA_TONGUE2_CLK1_N]
uTCA_TONGUE2_CLK1_P: C153.1 ; port uTCA_CLK.uTCA_TONGUE2_CLK1_P  [project net uTCA_CLK.uTCA_TONGUE2_CLK1_P]
uTCA_TONGUE2_CLK2_N: C149.1 ; port uTCA_CLK.uTCA_TONGUE2_CLK2_N  [project net uTCA_CLK.uTCA_TONGUE2_CLK2_N]
uTCA_TONGUE2_CLK2_P: C150.1 ; port uTCA_CLK.uTCA_TONGUE2_CLK2_P  [project net uTCA_CLK.uTCA_TONGUE2_CLK2_P]
NetC89_2: C89.2 IC12.2(~{Q}0) R92.1
NetC90_2: C90.2 IC12.1(Q0) R93.1
NetC99_2: C99.2 IC12.4(~{Q}1) R89.1
NetC101_2: C101.2 IC12.3(Q1) R91.1
NetC102_2: C102.2 IC12.6(~{Q}2) R88.1
NetC103_2: C103.2 IC12.5(Q2) R87.1
NetC122_2: C122.2 IC12.8(~{Q}3) R85.1
NetC125_2: C125.2 IC12.7(Q3) R84.1
NetC138_2: C138.2 IC12.10(~{Q}4) R82.1
NetC139_2: C139.2 IC12.9(Q4) R81.1
NetC140_1: C140.1 C141.2 C142.2 IC13.9(VCC_VCO) IC13.16(VCC_PLL2) IC13.18(VCC_PLL1) L6.1
NetC149_2: C149.2 IC16.42(~{OUT2}) R68.1
NetC150_2: C150.2 IC16.43(OUT2) R71.1
NetC152_2: C152.2 IC16.55(~{OUT0}) R72.1
NetC153_2: C153.2 IC16.56(OUT0) R73.1
NetC154_1: C154.1 IC13.21(XIN)
NetC154_2: C154.2 ; port CLK_25MHZ_DMTD_DAC
NetC155_1: C155.1 IC13.17(REG_CAP2)
NetC156_1: C156.1 IC13.19(REG_CAP1)
NetC158_2: C158.2 IC16.52(~{OUT1}) R246.1
NetC160_1: C160.1 C161.2 C163.2 IC16.4(VCP) L8.1
NetC164_1: C164.1 C165.2 C170.1 IC16.10(BYPASS) R79.1
NetC164_2: C164.2 IC16.9(LF) R80.1
NetC168_1: C168.1 R79.2
NetC168_2: C168.2 C170.2 IC16.5(CP) R80.2
NetC185_1: C185.1 ; port CLK_25MHZ_GTX_DAC
NetC185_2: C185.2 IC16.64(REFIN_(REF1))
NetC188_2: C188.2 IC16.63(~{REFIN}_(REF2))
NetC327_2: C327.2 IC16.53(OUT1) R247.1
NetC328_1: C328.1 IC13.12(~{RSTN})
NetC422_1: C422.1 IC16.35(OUT9_(OUT9A))
NetC422_2: C422.2 R65.2 Tr3.6(Pri+)
NetIC13_11: IC13.11(OS0) R60.1
NetIC13_13: IC13.13(OD0) R64.1
NetIC13_14: IC13.14(OD1) R62.1
NetIC13_15: IC13.15(OD2) R61.1
NetIC13_25: IC13.25(PR0) R66.1
NetIC13_26: IC13.26(PR1) R67.1
NetIC16_3: IC16.3(LD) R220.1
NetIC16_6: IC16.6(STATUS) R225.1
NetIC16_21: IC16.21(SDO) R223.1
NetIC16_22: IC16.22(SDIO) R224.1
NetIC16_28: IC16.28(OUT5) R70.1 R94.2
NetIC16_29: IC16.29(~{OUT5}) R30.1 R69.2
NetIC16_39: IC16.39(~{OUT3}) R63.1 R76.2
NetIC16_40: IC16.40(OUT3) R78.1 R255.2
NetIC16_58: IC16.58(RSET) R83.2
NetIC16_62: IC16.62(CPRSET) R86.2

Not connected (* = marked no-connect by the designer): IC12 15(VBB); IC13 23(OSC_OUT); IC16 2(REFMON) 13(CLK)* 14(~{CLK})* 36(~{OUT9}_(OUT9B))

### Layout directives
differential pair: (no net found under the mark), AUX_CLK_N, AUX_CLK_P, CLK0_N, CLK0_P, CLK1_N, CLK1_P, DMTD_CLK_N, DMTD_CLK_P, DMTDCLK_mB_N, DMTDCLK_mB_P, MGTREFCLK.MGTREFCLK112_N, MGTREFCLK.MGTREFCLK112_P, MGTREFCLK.MGTREFCLK113_N, MGTREFCLK.MGTREFCLK113_P, MGTREFCLK.MGTREFCLK114_N, MGTREFCLK.MGTREFCLK114_P, MGTREFCLK.MGTREFCLK115_N, MGTREFCLK.MGTREFCLK115_P, MGTREFCLK.MGTREFCLK116_N, MGTREFCLK.MGTREFCLK116_P, miniBACKPLANE_CLK_N, miniBACKPLANE_CLK_P, PLL_CLKS.REF_CLK_N, PLL_CLKS.REF_CLK_P, SERDES_CLK_N, SERDES_CLK_P, uTCA_CLK.uTCA_TONGUE2_CLK1_N, uTCA_CLK.uTCA_TONGUE2_CLK2_N, uTCA_CLK.uTCA_TONGUE2_CLK2_P

### Notes on the sheet
- 125MHz Clock to FPGA GTXs (LVPECL)
  According to Table 2-10 of UG366 for GigE:
  Line Rate [Gb/s] = 1.25
  PLL Frequency [GHz] = 2.5
  REFCLK[MHz] = 125
  N1 = 5
  N2 = 4
  D   = 4
  M   = 1
- 75R and 33R resistor for LVDS translation
- Output=62.5 MHz
- (near R249) Input = 25 MHz
- PRESC DIV = 4
- FB DIV = 20
- OUT DIV = 8
- (near IC13) PR[1:0] = 11
- (near IC13) OD[2:0] = 111
- (near IC13) 62.5MHz Clock for the DMTD Phase Detector in FPGA (LVDS)
- LVDS OUTPUTS
- Copyright CERN 2014.
  This documentation describes Open Hardware and is licensed under the CERN OHL v. 1.2. You may redistribute and modify this documentation under the terms of the CERN OHL v.1.2. (http://ohwr.org/CERNOHL). This documentation is distributed WITHOUT ANY EXPRESS OR IMPLIED WARRANTY, INCLUDING OF MERCHANTABILITY, SATISFACTORY QUALITY AND FITNESS FOR A PARTICULAR PURPOSE. Please see the CERN OHL v.1.2 for applicable conditions.
- Title:
- Size:
- Revision:
- A3
- Drawn by:
- Date:
- Sheet
- of
- Project:
- (in symbol AD9516, part A) LVPECL; LVDS/CMOS

### Library data of the parts
C89 C90 C99 C101-C103 C122 C125 C138 C139 C149 C150 C152-C154 C158 C185 C327 = CC0402_10NF_25V_10%_X7R: Capacitor; Manufacturer1: TDK; Manufacturer1 PN: C1005X7R1E103K; TC: X7R; Tolerance: ±10%; Voltage: 25V; Published: 8-Jun-2000; LatestRevisionDate: 17-Jul-2002; LatestRevisionNote: Re-released for DXP Platform.; PackageReference: RAD-0.3; Publisher: Altium Limited; Distributor1: Digikey; Distributor1 PN: 445-1260-1-ND; Case: 0402; Value: 10nF
C140 C144 C151 C155 C156 C161 C167 C175 = CC0603_10UF_6.3V_20%_X5R: Capacitor; Manufacturer1: TDK; Manufacturer1 PN: C1608X5R0J106M; TC: X5R; Tolerance: ±20%; Voltage: 6.3V; Published: 8-Jun-2000; LatestRevisionDate: 17-Jul-2002; LatestRevisionNote: Re-released for DXP Platform.; PackageReference: RAD-0.3; Publisher: Altium Limited; Distributor1: Digikey; Distributor1 PN: 445-4112-1-ND; Case: 0603; Value: 10uF
C141-C143 C146 C148 C159 C160 C169 C171-C174 C176-C178 C180 C181 C183 C184 C186 C187 C309 C328 C422 = CC0402_100NF_16V_10%_X7R: Capacitor; Manufacturer1: TDK; Manufacturer1 PN: C1005X7R1C104K; TC: X7R; Tolerance: ±10%; Voltage: 16V; Published: 8-Jun-2000; LatestRevisionDate: 17-Jul-2002; LatestRevisionNote: Re-released for DXP Platform.; PackageReference: RAD-0.3; Publisher: Altium Limited; Distributor1: Digikey; Distributor1 PN: 445-4952-1-ND; Case: 0402; Value: 100nF
C163 = CC0402_2.7NF_50V_10%_X7R: Capacitor; Manufacturer1: Panasonic; Manufacturer1 PN: ECJ-0EB1H272K; TC: X7R; Tolerance: ±10%; Voltage: 50V; Published: 8-Jun-2000; LatestRevisionDate: 17-Jul-2002; LatestRevisionNote: Re-released for DXP Platform.; PackageReference: RAD-0.3; Publisher: Altium Limited; Distributor1: Digikey; Distributor1 PN: PCC1726CT-ND; Case: 0402; Value: 2.7nF
C164 = CC0603_33PF_50V_5%_NP0: Capacitor; Manufacturer1: TDK; Manufacturer1 PN: C1608C0G1H330J; TC: COG; Tolerance: ±5%; Voltage: 50V; Published: 8-Jun-2000; LatestRevisionDate: 17-Jul-2002; LatestRevisionNote: Re-released for DXP Platform.; PackageReference: RAD-0.3; Publisher: Altium Limited; Distributor1: Digikey; Distributor1 PN: 445-1275-1-ND; Case: 0402; Value: 33pF
C165 C168 = CC0603_220NF_10V_10%_X7R: Capacitor; Manufacturer1: Yageo; Manufacturer1 PN: CC0603KRX7R6BB224; TC: X7R; Tolerance: ±10%; Voltage: 10V; Published: 8-Jun-2000; LatestRevisionDate: 17-Jul-2002; LatestRevisionNote: Re-released for DXP Platform.; PackageReference: RAD-0.3; Publisher: Altium Limited; Distributor1: Digikey; Distributor1 PN: 311-1346-1-ND; Case: 0402; Value: 220nF
C170 = CC0603_68PF_50V_5%_NP0: Capacitor; Manufacturer1: TDK Corporation; Manufacturer1 PN: C1608C0G1H680J; TC: COG; Tolerance: ±5%; Voltage: 50V; Published: 8-Jun-2000; LatestRevisionDate: 17-Jul-2002; LatestRevisionNote: Re-released for DXP Platform.; PackageReference: RAD-0.3; Publisher: Altium Limited; Distributor1: Digikey; Distributor1 PN: 445-1279-1-ND; Case: 0603; Value: 68pF
C188 = CC0402_10NF_25V_10%_X7R: Capacitor; Manufacturer1: TDK; Manufacturer1 PN: C1005X7R1E103K; TC: X7R; Tolerance: ±10%; Voltage: 25V; Value: 10nF; Published: 8-Jun-2000; LatestRevisionDate: 17-Jul-2002; LatestRevisionNote: Re-released for DXP Platform.; PackageReference: RAD-0.3; Publisher: Altium Limited; Distributor1: Digikey; Distributor1 PN: 445-1260-1-ND; Case: 0402
IC12 = MC100LVEP14DT: Low-Voltage 1:5 Differential LVECL/LVPECL/LVEPECL/HSTL Clock Driver; Published: 15-Apr-2002; LatestRevisionDate: 12-Dec-2006; LatestRevisionNote: IPC-7351 Footprint Added.; DatasheetVersion: Jan-2000; PackageVersion: Mar-2000; PackageReference: 948E-02; Publisher: Altium Limited; PackageDescription: 20-Pin Thin Small Outline Package 0.65 mm Pitch; ComponentLink1Description: Manufacturer Link; ComponentLink1URL: http://www.onsemi.com/; ComponentLink2Description: Datasheet; ComponentLink2URL: http://www.onsemi.com/pub/Collateral/MC100LVEP14-D.PDF
IC13 = CDCM61002: Low Jitter Clock Generator, Two Outpust, Integrated VCO; Manufacturer: Texas Instruments; Value: CDCM61002RHBT; Distributor1: Digikey; Distributor1 PN: 296-24193-1-ND
IC16 = AD9516: PLL with clock fanout; Value: AD9516-4BCPZ; Distributor1 PN: AD9516-4BCPZ-ND; Distributor1: Digikey
L6 L8 = L_FERRITE_BEAD: ferrite bead; Manufacturer1: Murata; Manufacturer1 PN: BLM18KG221SN1D; Current Rating: 2.2A; DCR: 50mOhm; Case: 0603; Distributor1: Digikey; Distributor1 PN: 490-5255-1-ND
R30 R63 R70 R78 = R0402_33R_±1%_0.1W_100PPM: SMD Resistor; Manufacturer1: Panasonic; Manufacturer1 PN: ERJ-2RKF33R0X; TCR: 100ppm; Power Rating: 0.1W; Tolerance: ±1%; Case: 0402; Distributor1: DigiKey; Distributor1 PN: P33.0LTR-ND; Value: 33R
R60-R62 R64-R67 = R0402_O.C.: SMD Resistor; Case: 0402; Manufacturer1: N/A; Manufacturer1 PN: N/A; Distributor1: N/A; Distributor1 PN: N/A; TCR: N/A; Power Rating: N/A; Tolerance: N/A; Value: o.c.
R68 R71-R73 R81 R82 R84 R85 R87-R89 R91-R93 R246 R247 = R0402_200R_±1%_0.1W_100PPM: SMD Resistor; Manufacturer1: Panasonic; Manufacturer1 PN: ERJ-2RKF2000X; TCR: 100ppm; Power Rating: 0.1W; Tolerance: ±1%; Case: 0402; Distributor1: DigiKey; Distributor1 PN: P200LCT-ND; Value: 200R
R69 R76 R94 R255 = R0402_75R_±1%_0.1W_100PPM: SMD Resistor; Manufacturer1: Panasonic; Manufacturer1 PN: ERJ-2RKF75R0X; TCR: 100ppm; Power Rating: 0.1W; Tolerance: ±1%; Case: 0402; Distributor1: DigiKey; Distributor1 PN: P75.0LCT-ND; Value: 75R
R79 = R0603_820R_±1%_0.1W_100PPM: SMD Resistor; Manufacturer1: Panasonic; Manufacturer1 PN: ERJ-3EKF8200V; TCR: 100ppm; Power Rating: 0.1W; Tolerance: ±1%; Case: 0603; Distributor1: DigiKey; Distributor1 PN: P820HCT-ND; Value: 820R
R80 = R0603_390R_±1%_0.1W_100PPM: SMD Resistor; Manufacturer1: Panasonic; Manufacturer1 PN: ERJ-3EKF3900V; TCR: 100ppm; Power Rating: 0.1W; Tolerance: ±1%; Case: 0603; Distributor1: DigiKey; Distributor1 PN: P390HCT-ND; Value: 390R
R83 = R0402_4K12_±1%_0.1W_100PPM: SMD Resistor; Manufacturer1: Panasonic; Manufacturer1 PN: ERJ-2RKF4121X; TCR: 100ppm; Power Rating: 0.1W; Tolerance: ±1%; Case: 0402; Distributor1: DigiKey; Distributor1 PN: P4.12KLCT-ND; Value: 4K12
R86 = R0402_5K1_±1%_0.1W_100PPM: SMD Resistor; Manufacturer1: Panasonic; Manufacturer1 PN: ERJ-2RKF5101X; TCR: 100ppm; Power Rating: 0.1W; Tolerance: ±1%; Case: 0402; Distributor1: DigiKey; Distributor1 PN: P5.10KLCT-ND; Value: 5K1
R90 R220 R223-R225 R245 = R0402_100R_±1%_0.1W_100PPM: as R43 on sheet FPGA_Configuration; Case: 0402; Distributor1: DigiKey; Distributor1 PN: P100LCT-ND; Value: 100R
R219 R221 R222 R226 = R0402_330R_±1%_0.1W_100PPM: as R46 on sheet FPGA_Configuration; Case: 0402; Distributor1: DigiKey; Distributor1 PN: P330LCT-ND; Value: 330R
R248 R249 = R0402_4.7K_±1%_0.1W_100PPM: as R45 on sheet FPGA_Configuration; Case: 0402; Distributor1: DigiKey; Distributor1 PN: ERJ-2RKF4701X; Value: 4K7
Tr3 = WBC1-1LB: SMT Mini WideBand Transformer 1:1, 10uH,; Manufacturer: Coilcraft; Published: 8-Jun-2000; LatestRevisionDate: 17-Jul-2002; LatestRevisionNote: Re-released for DXP Platform.; PackageReference: TRF_4; Publisher: Altium Limited; Manufacturer PN: WBC1-1LB

## Sheet FPGA_GPIOs.SchDoc: FPGA_GPIOs
size A4; Date: 18/06/2014; DrawnBy: J. Gabriel R.E.; Organization: Seven Solutions S.L.; Address1: C/Baza, Parcela 19, Nave 3; Address2: Polígono Ind. Juncaril; Address3: 18210-Peligros-Granada; Address4: Spain; Revision: 3.4; SheetNumber: 16; SheetTotal: 23; WebAddress: www.sevensols.com; Project: White Rabbit; ProjectName: White Rabbit
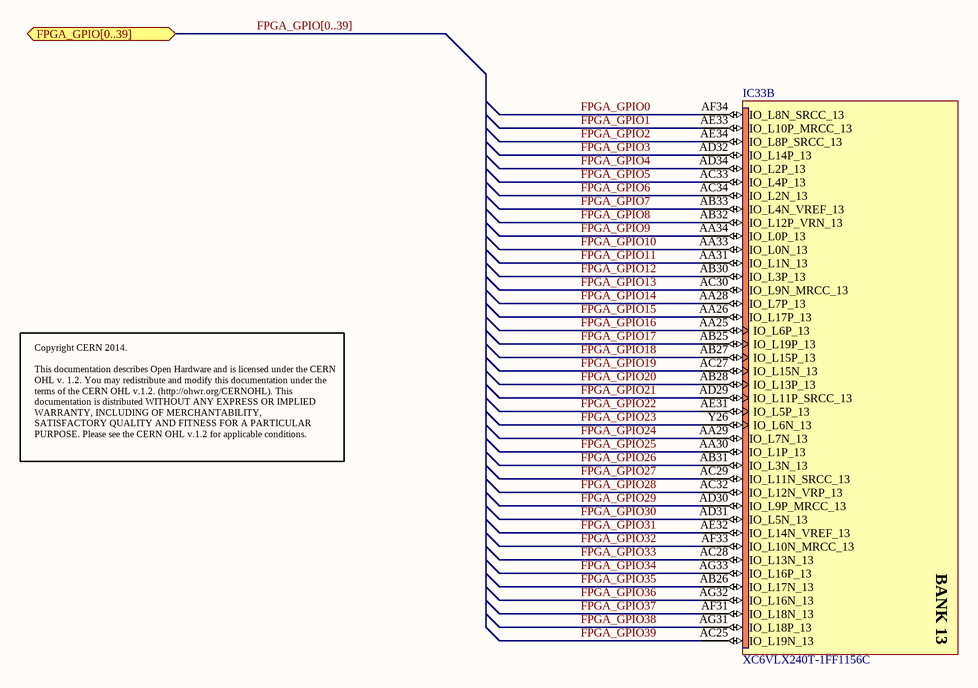
[diagram p14: FPGA_GPIOs.SchDoc]

### Parts
IC33  XC6VLX240T-1FF1156C  [FF1156]  (part B of 20)

### Ports
FPGA_GPIO[0..39] (bidir)

### Nets
FPGA_GPIO0: IC33.AF34(IO_L8N_SRCC_13)
FPGA_GPIO1: IC33.AE33(IO_L10P_MRCC_13)
FPGA_GPIO2: IC33.AE34(IO_L8P_SRCC_13)
FPGA_GPIO3: IC33.AD32(IO_L14P_13)
FPGA_GPIO4: IC33.AD34(IO_L2P_13)
FPGA_GPIO5: IC33.AC33(IO_L4P_13)
FPGA_GPIO6: IC33.AC34(IO_L2N_13)
FPGA_GPIO7: IC33.AB33(IO_L4N_VREF_13)
FPGA_GPIO8: IC33.AB32(IO_L12P_VRN_13)
FPGA_GPIO9: IC33.AA34(IO_L0P_13)
FPGA_GPIO10: IC33.AA33(IO_L0N_13)
FPGA_GPIO11: IC33.AA31(IO_L1N_13)
FPGA_GPIO12: IC33.AB30(IO_L3P_13)
FPGA_GPIO13: IC33.AC30(IO_L9N_MRCC_13)
FPGA_GPIO14: IC33.AA28(IO_L7P_13)
FPGA_GPIO15: IC33.AA26(IO_L17P_13)
FPGA_GPIO16: IC33.AA25(IO_L6P_13)
FPGA_GPIO17: IC33.AB25(IO_L19P_13)
FPGA_GPIO18: IC33.AB27(IO_L15P_13)
FPGA_GPIO19: IC33.AC27(IO_L15N_13)
FPGA_GPIO20: IC33.AB28(IO_L13P_13)
FPGA_GPIO21: IC33.AD29(IO_L11P_SRCC_13)
FPGA_GPIO22: IC33.AE31(IO_L5P_13)
FPGA_GPIO23: IC33.Y26(IO_L6N_13)
FPGA_GPIO24: IC33.AA29(IO_L7N_13)
FPGA_GPIO25: IC33.AA30(IO_L1P_13)
FPGA_GPIO26: IC33.AB31(IO_L3N_13)
FPGA_GPIO27: IC33.AC29(IO_L11N_SRCC_13)
FPGA_GPIO28: IC33.AC32(IO_L12N_VRP_13)
FPGA_GPIO29: IC33.AD30(IO_L9P_MRCC_13)
FPGA_GPIO30: IC33.AD31(IO_L5N_13)
FPGA_GPIO31: IC33.AE32(IO_L14N_VREF_13)
FPGA_GPIO32: IC33.AF33(IO_L10N_MRCC_13)
FPGA_GPIO33: IC33.AC28(IO_L13N_13)
FPGA_GPIO34: IC33.AG33(IO_L16P_13)
FPGA_GPIO35: IC33.AB26(IO_L17N_13)
FPGA_GPIO36: IC33.AG32(IO_L16N_13)
FPGA_GPIO37: IC33.AF31(IO_L18N_13)
FPGA_GPIO38: IC33.AG31(IO_L18P_13)
FPGA_GPIO39: IC33.AC25(IO_L19N_13)

### Buses and harness runs
bus FPGA_GPIO[0..39] = port FPGA_GPIO[0..39]

### Notes on the sheet
- Copyright CERN 2014.
  This documentation describes Open Hardware and is licensed under the CERN OHL v. 1.2. You may redistribute and modify this documentation under the terms of the CERN OHL v.1.2. (http://ohwr.org/CERNOHL). This documentation is distributed WITHOUT ANY EXPRESS OR IMPLIED WARRANTY, INCLUDING OF MERCHANTABILITY, SATISFACTORY QUALITY AND FITNESS FOR A PARTICULAR PURPOSE. Please see the CERN OHL v.1.2 for applicable conditions.
- Title:
- Size:
- Revision:
- A4
- Drawn by:
- Date:
- Sheet
- of
- Project:
- (in symbol XC6VLX130T-1FF1156C, part B) BANK 13

### Library data of the parts
IC33 = XC6VLX130T-1FF1156C: as IC33 on sheet FPGA_Configuration; FirstPublished: 17-Nov-2009; DatasheetVersion: v2.0, Sep-2009; PackageVersion: ver1.0, Jun-2009; PackageReference: FF1156; Publisher: Altium Limited; PackageDescription: 1156-Ball Flip-Chip Fine Pitch Ball Grid Array (FF1156); Code_JEDEC: MS-034-AAR-1; Code_IPC: BGA100P34X34-1156; ComponentLink1Description: Virtex-6 Datasheet; ComponentLink1URL: http://www.xilinx.com/support/documentation/data_sheets/ds150.pdf; ComponentLink2Description: Pinout Specification; ComponentLink2URL: http://www.xilinx.com/support/packagefiles/virtex-6-pkgs.htm; ComponentLink3Description: FF1156 Package Drawing; ComponentLink3URL: http://www.xilinx.com/support/documentation/package_specs/ff1156.pdf; ComponentLink4Description: Virtex-6 Documents; ComponentLink4URL: http://www.xilinx.com/support/documentation/virtex-6.htm; ComponentLink5Description: Xilinx.com Home; ComponentLink5URL: http://www.xilinx.com